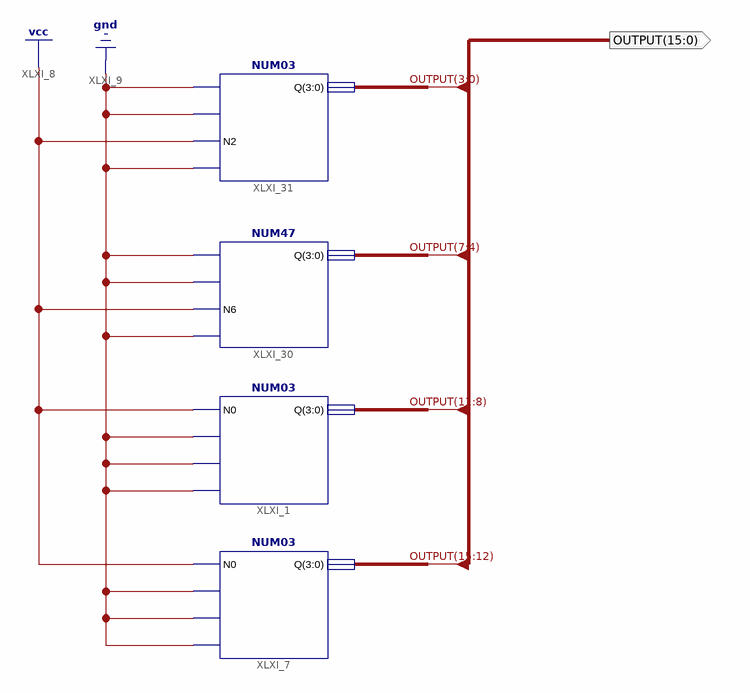
[diagram p0: schematic sheet 1]
// Xilinx ISE schematic BIN98.sch (spartan6) as structural Verilog: 4 symbols, 1 ports
module BIN98 (
  output [15:0] OUTPUT
);

  NUM03 XLXI_1 (.N2(1'b0), .N3(1'b0), .N0(1'b1), .N1(1'b0), .Q(OUTPUT[11:8]));
  NUM03 XLXI_7 (.N2(1'b0), .N3(1'b0), .N0(1'b1), .N1(1'b0), .Q(OUTPUT[15:12]));
  NUM47 XLXI_30 (.Q(OUTPUT[7:4]), .N5(1'b0), .N4(1'b0), .N6(1'b1), .N7(1'b0));
  NUM03 XLXI_31 (.N2(1'b1), .N3(1'b0), .N0(1'b0), .N1(1'b0), .Q(OUTPUT[3:0]));
endmodule
